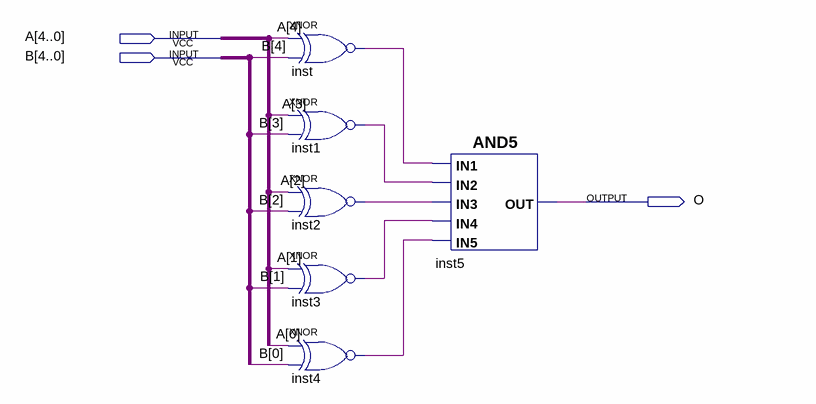
[diagram p0: schematic sheet]
// Quartus schematic xnor2-5.bdf as structural Verilog: 6 symbols, 3 pins
module \xnor2-5  (
  input  [4:0] A,
  input  [4:0] B,
  output O
);

  wire inst1_out, inst2_out, inst3_out, inst4_out, inst_out;

  xnor inst (inst_out, A[4], B[4]);
  xnor inst1 (inst1_out, A[3], B[3]);
  xnor inst2 (inst2_out, A[2], B[2]);
  xnor inst3 (inst3_out, A[1], B[1]);
  xnor inst4 (inst4_out, A[0], B[0]);
  and inst5 (O, inst_out, inst1_out, inst2_out, inst3_out, inst4_out);
endmodule
